# EAGLE design iGoGo-APRS-Tracker (EAGLE 6.6.0)
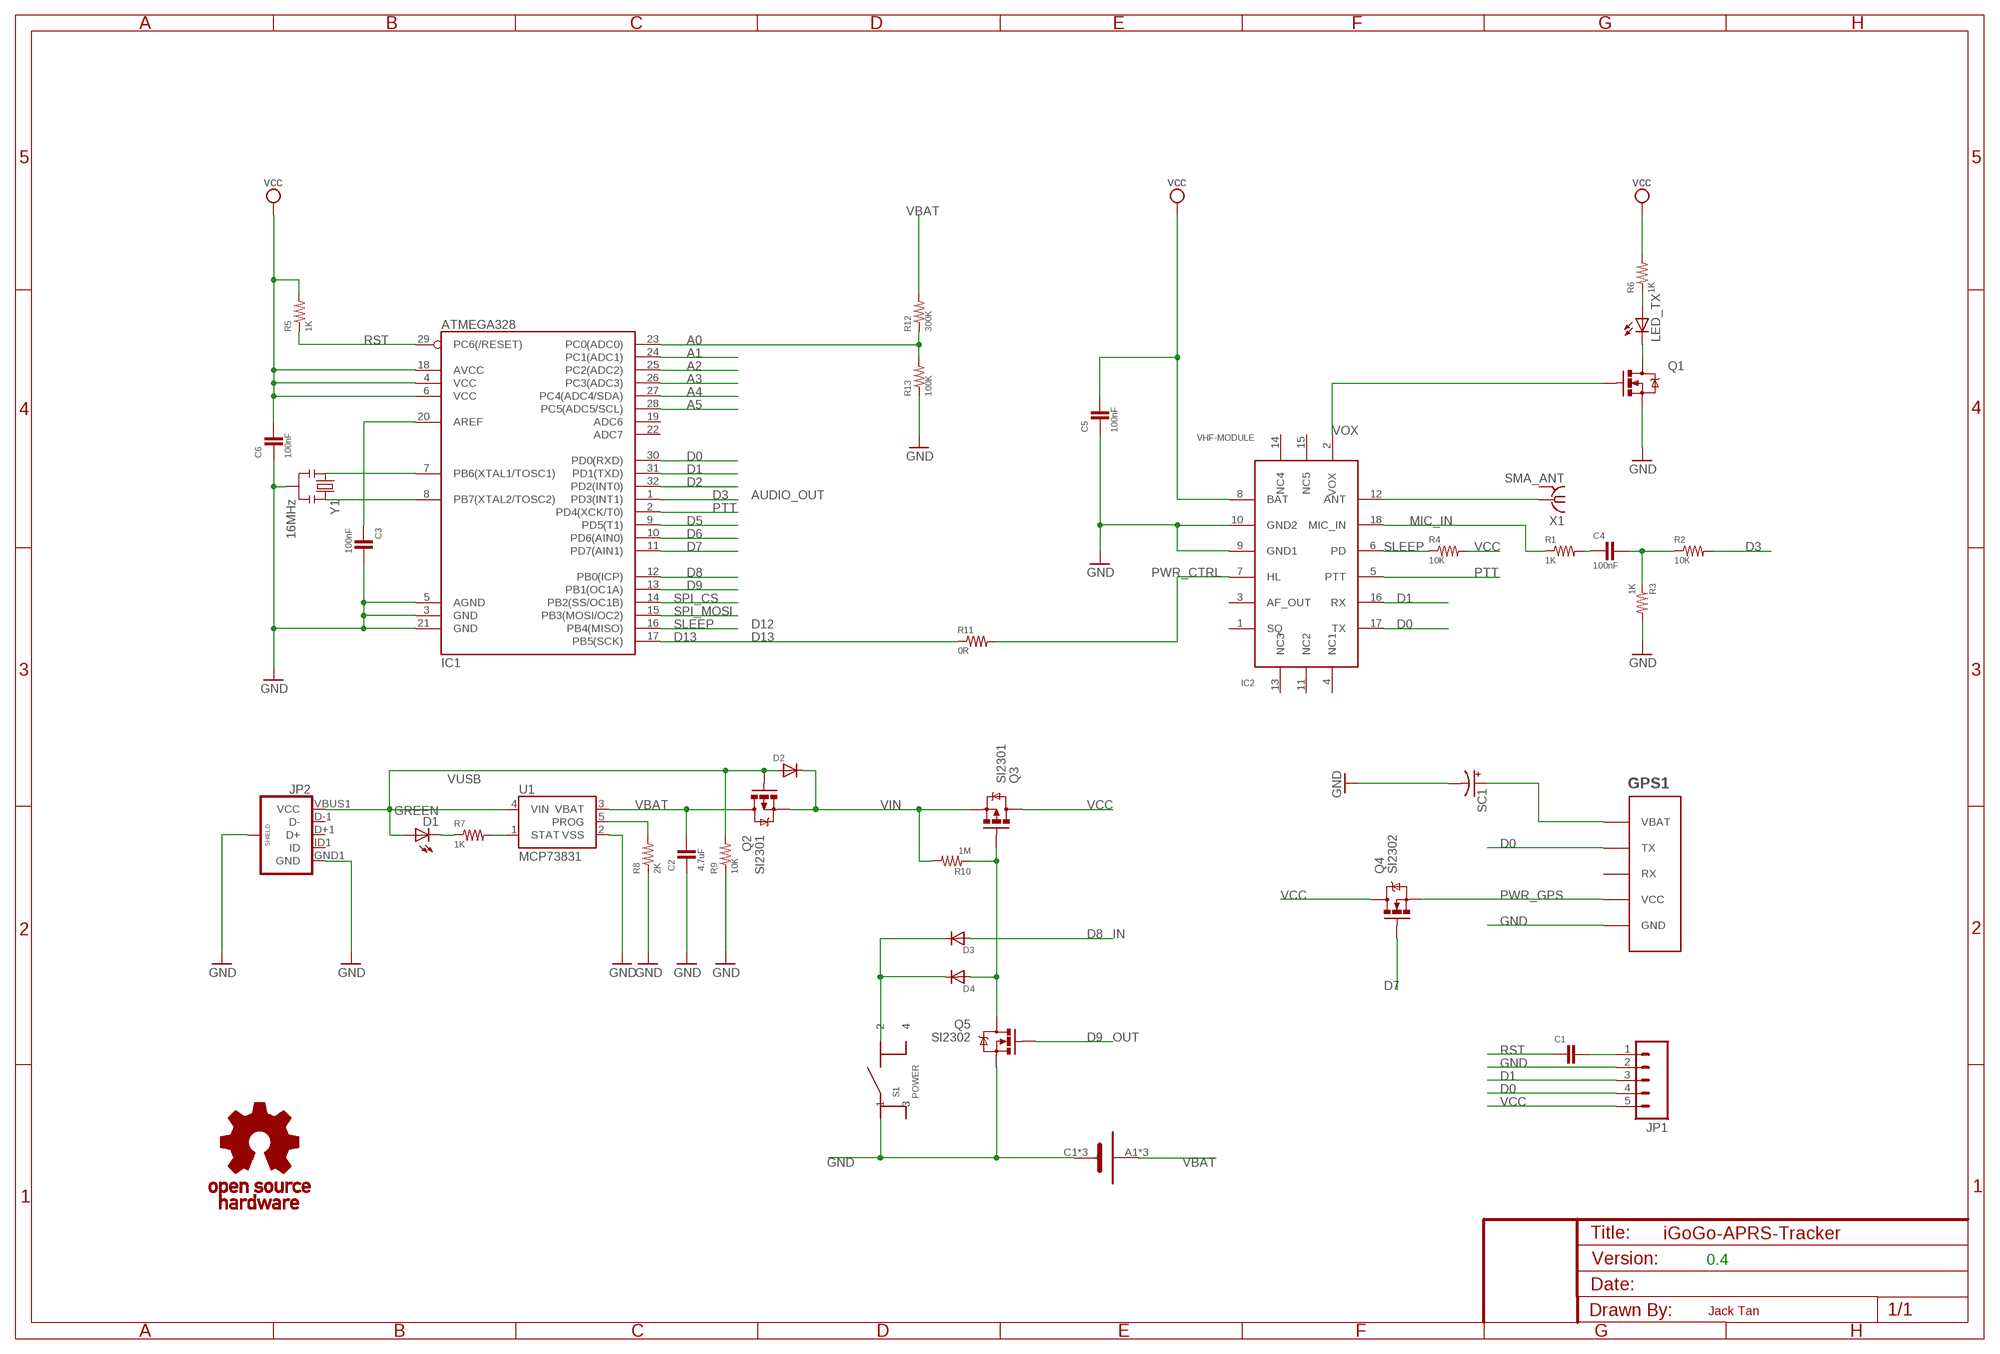
[diagram p0: schematic, sheet 1]

## Parts
B1  18650  [18650]
C1  0603-CAP  [0603-CAP]
C2  4.7uF  0603-CAP  [0603-CAP]
C3  100nF  0603-CAP  [0603-CAP]
C4  100nF  0603-CAP  [0603-CAP]
C5  100nF  0603-CAP  [0603-CAP]
C6  100nF  0603-CAP  [0603-CAP]
D1  GREEN  LED3MM  [LED3MM]
D2  DIODESOD  [SOD-323]
D3  DIODESOD  [SOD-323]
D4  DIODESOD  [SOD-323]
GPS1  GAM-1433  [GAM-1433]
IC1  ATMEGA328  ATMEGA168  [TQFP32-08]
IC2  VHF-MODULE  [VHF-MODULE]
JP1  M05PTH  [1X05]
JP2  USB_MICROB_PLUGCONN-11752  [USB-B-MICRO-SMD_V03]
LED_TX  LED3MM  [LED3MM]
Q1  MOSFET-N-SMD  [SOT23-3]
Q2  SI2301  MOSFET-P-SOT23  [SOT23]
Q3  SI2301  MOSFET-P-SOT23  [SOT23]
Q4  SI2302  MOSFET-N-SMD  [SOT23-3]
Q5  SI2302  MOSFET-N-SMD  [SOT23-3]
R1  1K  0603-RESISTOR  [0603-RES]
R2  10K  0603-RESISTOR  [0603-RES]
R3  1K  0603-RESISTOR  [0603-RES]
R4  10K  0603-RESISTOR  [0603-RES]
R5  1K  0603-RESISTOR  [0603-RES]
R6  1K  0603-RESISTOR  [0603-RES]
R7  1K  0603-RESISTOR  [0603-RES]
R8  2K  0603-RESISTOR  [0603-RES]
R9  10K  0603-RESISTOR  [0603-RES]
R10  1M  0603-RESISTOR  [0603-RES]
R11  0R  0603-RESISTOR  [0603-RES]
R12  300K  0402-RESISTOR  [0402-RES]
R13  100K  0402-RESISTOR  [0402-RES]
S1  POWER  SWITCH-4DIP  [SWITCH-TS-038]
SC1  SC-3.3-0.22F  [SC-3.3-0.22F]
U1  MCP73831  [SOT23-5]
U$1  OPEN_HARDWARE_LOGO  [OPEN_HARDWARE_LOGO]
X1  SMA_ANT  SMA--KE  [SMA-KE]
Y1  16MHz  RESONATOR16MHZ  [RESONATOR-SMD]

## Nets
A0: IC1.23(PC0(ADC0)) R12.1 R13.2
A1: IC1.24(PC1(ADC1))
A2: IC1.25(PC2(ADC2))
A3: IC1.26(PC3(ADC3))
A4: IC1.27(PC4(ADC4/SDA))
A5: IC1.28(PC5(ADC5/SCL))
D0: GPS1.P$2(TX) IC1.30(PD0(RXD)) IC2.17(TX) JP1.4
D1: IC1.31(PD1(TXD)) IC2.16(RX) JP1.3
D2: IC1.32(PD2(INT0))
D3: IC1.1(PD3(INT1)) R2.2
D5: IC1.9(PD5(T1))
D6: IC1.10(PD6(AIN0))
D7: IC1.11(PD7(AIN1)) Q4.1(G)
D8: D3.2(A) IC1.12(PB0(ICP))
D9: IC1.13(PB1(OC1A)) Q5.1(G)
D13: IC1.17(PB5(SCK)) R11.1
GND: B1.C1(-) B1.C2(-) B1.C3(-) C2.1 C3.2 C5.1 C6.1 GPS1.P$5(GND) IC1.3(GND) IC1.5(AGND) IC1.21(GND) IC2.9(GND1) IC2.10(GND2) JP1.2 JP2.GND1(GND) JP2.SHIELD1(SHIELD) JP2.SHIELD2(SHIELD) JP2.SHIELD3(SHIELD) Q1.2(S) Q5.2(S) R3.2 R8.1 R9.1 R13.1 S1.1 SC1.2(-) U1.2(VSS) Y1.2
MIC_IN: IC2.18(MIC_IN) R1.1
N$1: IC1.7(PB6(XTAL1/TOSC1)) Y1.1
N$2: IC1.8(PB7(XTAL2/TOSC2)) Y1.3
N$3: IC2.12(ANT) X1.1
N$4: C4.1 R1.2
N$5: C4.2 R2.1 R3.1
N$6: C3.1 IC1.20(AREF)
N$7: D4.2(A) Q3.1(G) Q5.3(D) R10.1
N$8: LED_TX.K(C) Q1.3(D)
N$9: LED_TX.A R6.1
N$10: GPS1.P$1(VBAT) SC1.1(+)
N$11: C1.2 JP1.1
N$13: D1.K(C) R7.1
N$14: R7.2 U1.1(STAT)
N$15: R8.2 U1.5(PROG)
N$16: D3.1(C) D4.1(C) S1.2
PTT: IC1.2(PD4(XCK/T0)) IC2.5(PTT)
PWR_CTRL: IC2.7(HL) R11.2
PWR_GPS: GPS1.P$4(VCC) Q4.2(S)
RST: C1.1 IC1.29(PC6(/RESET)) R5.1
SLEEP: IC1.16(PB4(MISO)) IC2.6(PD) R4.1
SPI_CS: IC1.14(PB2(SS/OC1B))
SPI_MOSI: IC1.15(PB3(MOSI/OC2))
VBAT: B1.A1(+) B1.A2(+) B1.A3(+) C2.2 Q2.3(D) R12.2 U1.3(VBAT)
VCC: C5.2 C6.2 IC1.4(VCC) IC1.6(VCC) IC1.18(AVCC) IC2.8(BAT) JP1.5 Q3.3(D) Q4.3(D) R4.2 R5.2 R6.2 ; supply symbol labelled vcc
VIN: D2.1(C) Q2.2(S) Q3.2(S) R10.2
VOX: IC2.2(VOX) Q1.1(G)
VUSB: D1.A D2.2(A) JP2.VBUS1(VCC) Q2.1(G) R9.2 U1.4(VIN)
Unconnected: GPS1.P$3(RX) IC1.19(ADC6) IC1.22(ADC7) IC2.1(SQ) IC2.3(AF_OUT) IC2.4(NC1) IC2.11(NC2) IC2.13(NC3) IC2.14(NC4) IC2.15(NC5) JP2.D+1(D+) JP2.D-1(D-) JP2.ID1(ID) S1.3 S1.4

## Notes on the sheet
- AUDIO_OUT
- D12
- D13
- IN
- OUT
- 0.4
- Jack Tan

## Power pins joined to a net without a drawn wire
GND: X1.G@1(GND) X1.G@2(GND) X1.G@3(GND) X1.G@4(GND)

## Library data of the parts
B1 = ehl:18650
C1-C6 = ehl:0603-CAP
D1 LED_TX = adafruit:LED: LED OSRAM: - CHIPLED LG R971, LG N971, LY N971, LG Q971, LY Q971, LO R971, LY R971 LH N974, LH R974 LS Q976, LO Q976, LY Q976 LO Q996 - Hyper CHIPLED LW Q18S LB Q993, LB Q99A, LB R99A - SideLED LS A670, LO A670, LY A670, LG A670, LP A670 LB A673, LV A673, LT A673, LW A673 LH A674 LY A675 LS A676, LA A676, LO A676, LY A676, LW A676 LS A679, LY A679, LG A679 - Hyper Micro SIDELED® LS Y876, LA Y876, LO Y876, LY Y876 LT Y87S - SmartLED LW L88C, LW L88S LB L89C, LB L89S, LG L890 LS L89K, LO L89K, LY L89K LS L896, LA L896, LO L896, LY L896 - TOPLED LS T670, LO T670, LY T670, LG T670, LP T670 LSG T670, LSP T670, LSY T670, LOP T670, LYG T670 LG T671, LOG T671, LSG T671 LB T673, LV T673, LT T673, LW T673 LH T674 LS T676, LA T676, LO T676, LY T676, LB T676, LH T676, LSB T676, LW T676 LB T67C, LV T67C, LT T67C, LS T67K, LO T67K, LY T67K, LW E67C LS E67B, LA E67B, LO E67B, LY E67B, LB E67C, LV E67C, LT E67C LW T67C LS T679, LY T679, LG T679 LS T770, LO T770, LY T770, LG T770, LP T770 LB T773, LV T773, LT T773, LW T773 LH T774 LS E675, LA E675, LY E675, LS T675 LS T776, LA T776, LO T776, LY T776, LB T776 LHGB T686 LT T68C, LB T68C - Hyper Mini TOPLED® LB M676 - Mini TOPLED Santana® LG M470 LS M47K, LO M47K, LY M47K Source: http://www.osram.convergy.de/
D2-D4 = ehl:DIODE: Diode These are standard reverse protection diodes and small signal diodes. SMA package can handle up to about 1A. SOD-323 can handle about 200mA. What the SOD-323 package when ordering, there are some mfgs out there that are 5-pin packages.
GPS1 = ehl:GAM-1433
IC1 = ehl:ATMEGA168
IC2 = ehl:VHF-MODULE
JP1 = ehl:M05: Header 5 Standard 5-pin 0.1" header. Use with straight break away headers (SKU : PRT-00116), right angle break away headers (PRT-00553), swiss pins (PRT-00743), machine pins (PRT-00117), and female headers (PRT-00115). Molex polarized connector foot print use with SKU : PRT-08230 with associated crimp pins and housings.
JP2 = ehl:USB_MICROB_PLUG: USB Micro-B connectors Some male, some female. Watch your step!; PROD_ID: CONN-11752
Q1 Q4 Q5 = ehl:MOSFET-N
Q2 Q3 = ehl:MOSFET-P
R1-R11 = ehl:0603-RESISTOR
R12 R13 = ehl:0402-RESISTOR
S1 = ehl:SWITCH-4DIP
SC1 = ehl:SC-3.3-0.22F
U1 = ehl:MCP73831: Miniature single cell, fully integrated Li-Ion, Li-polymer charge management controller http://ww1.microchip.com/downloads/en/DeviceDoc/21984a.pdf IC-09995; PROD_ID: IC-09995
U$1 = ehl:OPEN_HARDWARE_LOGO
X1 = dtoy-RF:SMA-: SMA 50 Ohm End Launch Jack Receptacle - Round Contact Johnson Components Source: www.johnsoncomponents.com .. J502-ND.pdf
Y1 = ehl:RESONATOR: Resonator Small SMD resonator. Used, eg, on the Arduino Pro/ Pro Mini boards. 8MHz- XTAL-08895 16MHz- XTAL-08900; PROD_ID: XTAL-08900

## Board
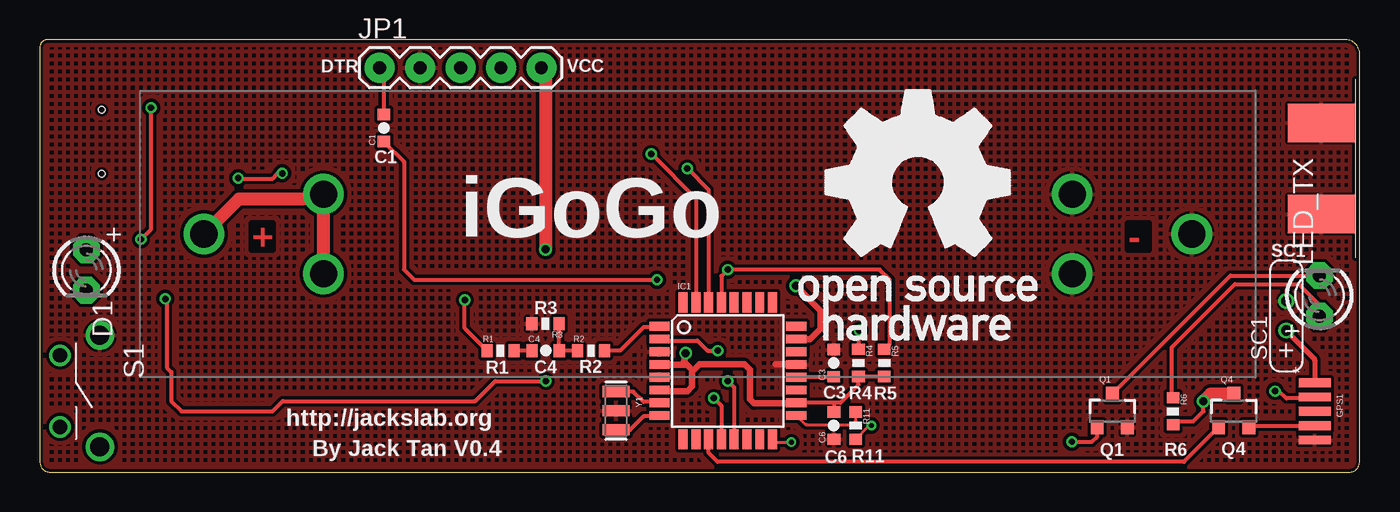
[diagram p1: board, top side]
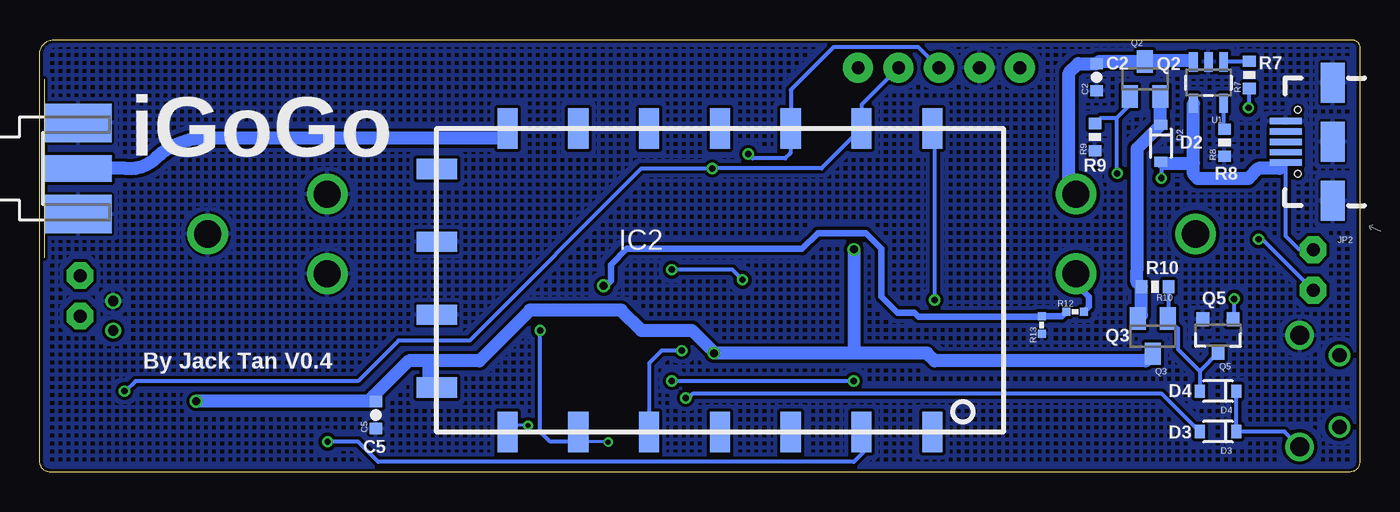
[diagram p2: board, bottom side, seen from below]

Size 82.84 x 27.12 mm. Coordinates in mm from the lower left corner, seen from the top.
Outline: 0,26.69 0,0.64 arc90 0.64,0 82.19,0 arc90 82.83,0.64 82.83,26.13 arc90 82.07,27.12 0.51,27.12 arc90 0,26.69
Copper layers (1*16): Top 0.035mm / dielectric 1.5mm / Bottom 0.035mm
Design rules "jackslab-micromod": minimum track width 6mil, minimum drill 0.3mm, track to track 6mil, track to pad 6mil, pad to pad 6mil, via to via 6mil, smd to smd 6mil, copper to edge 6mil, drill to drill 6mil, minimum pad ring 6mil, minimum via ring 6mil, stop-mask expansion 4mil, vias tented up to drill 20mil, thermal gap 6mil

### Footprints (pad centres in the part's own frame; a part is rotated, then mirrored left to right if it is on the bottom)
18650 = drill 1.7: A1 -31,0; A2 -23.5,2.5; A3 -23.5,-2.5; C1 31,0; C2 23.5,2.5; C3 23.5,-2.5
0603-CAP = smd 0.7 x 0.8: 1 -0.85,0; 2 0.85,0
LED3MM = drill 0.813 pad 1.676 octagon: A -1.27,0; K 1.27,0
SOD-323 = smd 0.63 x 0.83: 1 -1.15,0; 2 1.15,0
GAM-1433 = smd 0.55 x 2: P$1 -1.8,0; P$2 -0.9,0; P$3 0,0; P$4 0.9,0; P$5 1.8,0
TQFP32-08 = smd 1.27 x 0.559: 1 -4.293,2.8; 2 -4.293,2; 3 -4.293,1.2; 4 -4.293,0.4; 5 -4.293,-0.4; 6 -4.293,-1.2; 7 -4.293,-2; 8 -4.293,-2.8; 17 4.293,-2.8; 18 4.293,-2; 19 4.293,-1.2; 20 4.293,-0.4; 21 4.293,0.4; 22 4.293,1.2; 23 4.293,2; 24 4.293,2.8 | smd 0.559 x 1.27: 9 -2.8,-4.293; 10 -2,-4.293; 11 -1.2,-4.293; 12 -0.4,-4.293; 13 0.4,-4.293; 14 1.2,-4.293; 15 2,-4.293; 16 2.8,-4.293; 25 2.8,4.293; 26 2,4.293; 27 1.2,4.293; 28 0.4,4.293; 29 -0.4,4.293; 30 -1.2,4.293; 31 -2,4.293; 32 -2.8,4.293
VHF-MODULE = smd 1.27 x 2.54: 1 13.335,-10.16; 2 8.89,-10.16; 3 4.445,-10.16; 4 0,-10.16; 5 -4.445,-10.16; 6 -8.89,-10.16; 7 -13.335,-10.16; 12 -13.335,8.89; 13 -8.89,8.89; 14 -4.445,8.89; 15 0,8.89; 16 4.445,8.89; 17 8.89,8.89; 18 13.335,8.89 | smd 2.54 x 1.27: 8 -17.78,-7.366; 9 -17.78,-2.794; 10 -17.78,1.778; 11 -17.78,6.35
1X05 = drill 0.8 pad 1.88: 1 0,0; 2 2.54,0; 3 5.08,0; 4 7.62,0; 5 10.16,0
USB-B-MICRO-SMD_V03 = smd 2 x 0.4: D+1 2.954,0; D-1 2.954,0.65; GND1 2.954,-1.3; ID1 2.954,-0.65; VBUS1 2.954,1.3 | smd 1.5 x 2.5: SHIELD1 0,3.7; SHIELD2 0,-3.7; SHIELD3 0,0 | hole 0.4: 2.2,2; 2.2,-2
SOT23-3 = smd 0.8 x 0.9: 1 -0.95,-1; 2 0.95,-1; 3 0,1.1
SOT23 = smd 1 x 1.4: 1 -0.95,-1.1; 2 0.95,-1.1; 3 0,1.1
0603-RES = smd 0.7 x 0.8: 1 -0.85,0; 2 0.85,0
0402-RES = smd 0.5 x 0.5: 1 -0.55,0; 2 0.55,0
SWITCH-TS-038 = drill 1.2: 1 -3.5,2.5; 2 3.5,2.5 | drill 0.9: 3 -2.25,0; 4 2.25,0
SC-3.3-0.22F = drill 0.65: 1 -0.925,0; 2 0.925,0
SOT23-5 = smd 0.55 x 1.2: 1 -0.95,-1.3; 2 0,-1.3; 3 0.95,-1.3; 4 0.95,1.3; 5 -0.95,1.3
SMA-KE = smd 4.191 x 1.651: 1 2.115,0 | smd 4.191 x 2.413: G@1 2.115,2.86; G@2 2.115,-2.86 | smd 4.191 x 2.413 bottom: G@3 2.115,2.86; G@4 2.115,-2.86
RESONATOR-SMD = smd 0.7 x 1.7: 1 -1.2,0; 2 0,0; 3 1.2,0

### Placement (x,y rotation side)
B1  41.3,14.94 0 top
C1  21.59,21.59 90 top
C2  16.51,24.77 90 bottom
C3  49.83,6.84 90 top
C4  31.75,7.62 0 top
C5  61.75,3.58 90 bottom
C6  49.83,2.92 90 top
D1  2.92,12.68 270 top
D2  12.48,20.63 270 bottom
D3  8.89,2.54 180 bottom
D4  8.89,5.08 180 bottom
GPS1  80.01,3.81 270 top
IC1  43.18,6.35 0 top
IC2  40.15,12.67 0 bottom
JP1  21.32,25.37 0 top
JP2  1.69,20.72 180 bottom
LED_TX  80.31,11.06 90 top
Q1  67.31,3.81 0 top
Q2  13.47,24.67 0 bottom
Q3  12.98,8.53 180 bottom
Q4  74.93,3.81 0 top
Q5  8.89,8.59 180 bottom
R1  28.91,7.62 0 top
R2  34.59,7.62 0 top
R3  31.73,9.3 180 top
R4  51.38,6.85 270 top
R5  53,6.85 270 top
R6  71.12,3.81 270 top
R7  6.93,24.92 90 bottom
R8  8.48,20.67 90 bottom
R9  16.61,21.02 90 bottom
R10  12.84,11.63 180 bottom
R11  51.21,2.92 270 top
R12  17.86,10.05 0 bottom
R13  19.96,9.22 90 bottom
S1  1.27,5.08 270 top
SC1  78.23,9.8 90 top
U1  9.49,24.43 180 bottom
U$1  47.62,8.26 0 top
X1  82.55,19.05 0 bottom
Y1  36.17,3.86 270 top

### Tracks (layer width: path | path; a pad name or v marks a point on that pad's centre or on a via)
A0  (via drill 0.5)
  Top 0.406: v47.45,11.68 49,10.13 49,9 48.35,8.35 IC1.23
  Bottom 0.406: R12.1 18.7,9.77 R13.2 19.97,9.75 27.69,9.75 27.93,10 29,10 30,11 30,14 31,15 34,15 35,14 46,14 47,13 47,12 47.32,11.68 v47.45,11.68
D0  (via drill 0.4)
  Top 0.254: v40.64,19.05 41.98,17.71 IC1.30 | GPS1.P$2 79.92,4.62 78.23,4.62 77.78,5.08 v77.52,5.08
  Bottom 0.254: JP1.4 31.26,23.05 IC2.17 33.77,19.05 v40.64,19.05 45.09,19.05 55.88,8.26 60.33,8.26 62.87,5.71 76.83,5.71 77.47,5.08 v77.52,5.08
D1  (via drill 0.4)
  Top 0.254: v38.38,19.96 41.18,17.16 IC1.31
  Bottom 0.254: JP1.3 27.7,26.67 33.02,26.67 35.71,23.98 IC2.16 35.74,21.53 35.74,20.02 36.07,19.68 38.1,19.68 v38.38,19.96
D3
  Top 0.254: IC1.1 38.84,9.1 37.9,9.1 36.42,7.62 R2.2
D7
  Top 0.254: Q4.1 71.81,0.64 42.55,0.64 41.98,1.2 IC1.11
D8  (via drill 0.4)
  Top 0.254: v42.29,4.65 42.78,4.16 IC1.12
  Bottom 0.254: D3.2 12.4,4.9 41.88,4.9 42.14,4.65 v42.29,4.65
D9  (via drill 0.4)
  Top 0.254: v7.87,10.87 7.98,10.77 7.98,6.55 8.26,6.27 8.26,4.45 8.89,3.81 14.61,3.81 15.24,4.45 27.3,4.45 28.57,5.71 v31.75,5.71 | v43.18,5.71 43.58,5.32 IC1.13
  Bottom 0.254: Q5.1 8.01,9.53 8.26,9.53 7.87,9.91 v7.87,10.87 | v31.75,5.71 v43.18,5.71
D13
  Top 0.203: IC1.17 47.98,3.05 arc45 48.16,2.97 51,2.97 51.13,3.1 arc45 51.21,3.28 R11.1
GND
  Top 0.406: IC1.21 47.45,6.73 47.43,6.76 46.18,6.76
  pour Bottom (isolate 0.203, hatched): -1.27,29.21 83.82,29.21 83.82,-1.27 -1.27,-1.27
  pour Top (isolate 0.203, hatched): -2.54,30.48 85.09,30.48 85.09,-2.54 -2.54,-2.54
MIC_IN  (via drill 0.4)
  Top 0.254: R1.1 26.67,9.01 v26.67,10.79
  Bottom 0.254: v26.67,10.79 26.67,21.59 26.7,21.56 IC2.18
N$1
  Top 0.254: IC1.7 38.84,4.4 37.9,4.4 37.24,5.06 Y1.1
N$2
  Top 0.254: IC1.8 38.84,3.5 37.9,3.5 37.06,2.66 Y1.3
N$3
  Bottom 0.813: IC2.12 arc90 54.09,20.95 72.39,20.95 arc-44 75.56,19.68 arc50 77.47,19.05 X1.1 80.64,19.05
N$4
  Top 0.254: C4.1 R1.2
N$5
  Top 0.254: R2.1 C4.2 32.58,7.64 R3.1
N$6
  Top 0.254: C3.1 49.79,5.95 IC1.20
N$7
  Bottom 0.254: Q5.3 10.04,6.34 | 10.04,6.34 D4.2 | R10.1 11.99,9.67 Q3.1 11.4,9 11.4,7.7 10.04,6.34
N$8
  Top 0.254: Q1.3 74.73,12.33 LED_TX.K
N$9
  Top 0.254: R6.1 R6.1 arc-45 71.04,4.84 71.04,7.82 75.01,11.79 79.02,11.79 80.31,10.49 LED_TX.A
N$10
  Top 0.305: SC1.1 79.94,7.18 arc-45 80.01,7 GPS1.P$1
N$11
  Top 0.254: JP1.1 21.59,25.1 C1.2
N$13  (via drill 0.4)
  Top 0.254: v6.35,14.61 6.99,15.24 v6.99,22.86
  Bottom 0.254: D1.K 6.12,14.61 v6.35,14.61 | v6.99,22.86 6.93,22.91 R7.1
N$14
  Bottom 0.254: U1.1 8.5,25.77 R7.2
N$15
  Bottom 0.254: R8.2 8.54,21.58 U1.5
N$16
  Bottom 0.254: S1.2 4.73,2.54 D3.1 D4.1
PTT  (via drill 0.4)
  Top 0.254: IC1.2 38.98,8.26 41.27,8.26 41.91,7.62 v42.55,7.62
  Bottom 0.254: v42.55,7.62 43.81,7.62 44.6,6.84 IC2.5
PWR_CTRL  (via drill 0.3)
  Top 0.203: R11.2 51.98,2.85 arc-45 52.16,2.92 v52.2,2.92
  Bottom 0.203: v52.2,2.92 arc-45 52.26,2.95 52.81,2.95 53.17,2.58 arc45 53.35,2.51 IC2.7
PWR_GPS
  Top 0.254: Q4.2 75.98,2.91 GPS1.P$4
RST  (via drill 0.4)
  Top 0.254: C1.1 22.86,19.47 22.86,12.7 23.5,12.06 v38.73,12.06 | IC1.29 42.78,12.3 v43.18,12.7 52.7,12.7 53.34,12.06 53.34,8.04 R5.1
  Bottom 0.254: v38.73,12.06 39.37,12.7 v43.18,12.7
SLEEP  (via drill 0.3, 0.4)
  Top 0.203: IC1.16 46.08,1.95 arc45 46.26,1.88 v47.17,1.88
  Top 0.254: v51.44,8.89 51.38,8.84 R4.1
  Bottom 0.203: v47.17,1.88 arc-45 47.23,1.91 48.56,1.91 48.97,2.31 arc45 49.04,2.49 IC2.6
  Bottom 0.254: IC2.6 49.65,1.91 50.8,1.91 51.44,2.54 v51.44,8.89
VBAT
  Top 0.813: B1.A1 12.51,17.14 16.51,17.14 17.44,17.44 B1.A2 B1.A3
  Bottom 0.406: R12.2 17,10.36 17,11 17.8,11.8 B1.A3
  Bottom 0.61: 10.77,25.83 10.87,25.73 U1.3
  Bottom 0.813: B1.A2 18.24,17.88 18.24,25.04 17.66,25.62 C2.2 16.36,25.77 Q2.3 13.41,25.83 10.77,25.83
VCC  (via drill 0.5)
  Top 0.254: R5.2 R4.2 51.38,5.49 50.25,4.35 49.89,4.35 | 38.91,6.73 IC1.4 38.87,6.73 | 47.41,4.29 IC1.18 49.89,4.35 | R6.2 71.33,3.17 72.39,3.17 73.03,3.81 v73.03,4.45 | C6.2 arc45 49.89,3.89 49.89,4.35
  Top 0.406: IC1.6 38.96,5.08 40.64,5.08 40.95,5.38 40.95,6.43 | 40.95,6.43 40.62,6.75 | 40.62,6.75 IC1.4 | 47.57,4.45 IC1.18 47.44,4.32 44.83,4.32 44.58,4.57 44.58,6.43 44.22,6.78 41.4,6.78 41.05,6.43 40.95,6.43 | 40.62,6.75 40.44,6.93 v40.54,7.47
  Top 0.813: JP1.5 31.75,25.1 v31.75,13.97 | v73.03,4.45 73.49,4.91 Q4.3
  Bottom 0.203: C5.2 61.84,4.52 arc45 61.91,4.7 61.91,4.76
  Bottom 0.254: IC2.8 57.71,5.08
  Bottom 0.406: v40.54,7.47 40.32,7.46 40.8,7.71
  Bottom 0.813: Q3.3 13.43,6.99 26.67,6.99 27.15,7.47 31.75,7.47 | 58.42,6.99 55.24,6.99 52.07,10.16 46.35,10.16 45.09,8.89 41.91,8.89 40.54,7.52 v40.54,7.47 31.75,7.47 | 58.42,6.99 59.69,6.99 61.91,4.76 62.23,4.45 v73.03,4.45 | v31.75,13.97 31.75,7.47 | 57.71,5.08 58.42,5.79 58.42,6.99
VIN
  Bottom 0.254: D2.1 12.52,21.82
  Bottom 0.813: 12.52,21.82 Q2.2 | D2.1 13.97,20.29 13.97,13.34 13.97,12.7 13.97,11.91 R10.2 13.69,9.87 Q3.2
VOX  (via drill 0.4)
  Top 0.254: v64.77,1.91 66.04,1.91 66.36,2.23 Q1.1
  Bottom 0.254: IC2.2 31.11,2.36 31.11,1.27 31.75,0.64 61.59,0.64 62.87,1.91 v64.77,1.91
VUSB  (via drill 0.4)
  Top 0.254: v12.45,18.44 12.47,18.41 14.61,18.41 14.94,18.75 v15.21,18.75
  Bottom 0.254: R9.2 16.25,22.23 15.24,22.23 | 15.24,22.23 14.42,23.05 Q2.1 | U1.4 10.41,23.1 | D1.A 2.94,13.97 3.81,13.97 4.64,14.8 JP2.VBUS1 | 12.38,19.38 D2.2 12.45,19.45 v12.45,18.44 | v15.21,18.75 15.24,18.77 15.24,22.23
  Bottom 0.406: JP2.VBUS1 4.96,19.1 4.98,19.1
  Bottom 0.813: 4.98,19.1 5.03,19.05 6.35,19.05 6.99,18.41 10.16,18.41 10.44,18.7 10.44,19.38 | 10.44,19.38 U1.4 | 12.38,19.38 10.44,19.38

### Text on the board
tPlace: DTR | VCC | C1 | iGoGo | SC1 | R3 | R1 | C4 | R2 | C3 | R4 | R5 | http://jackslab.org | By Jack Tan V0.4 | C6 | R11 | Q1 | R6 | Q4
bPlace: R7 | Q2 | C2 | D2 | iGoGo | R9 | R8 | R10 | Q5 | Q3 | By Jack Tan V0.4 | D4 | D3 | C5